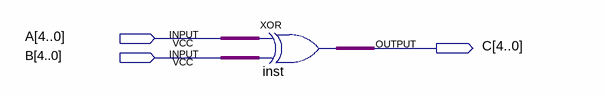
[diagram p0: schematic sheet]
// Quartus schematic xor_module.bdf as structural Verilog: 1 symbols, 3 pins
module xor_module (
  input  [4:0] A,
  input  [4:0] B,
  output [4:0] C
);

  assign C = A ^ B;  // XOR inst, 5 bits wide
endmodule
